# EAGLE design OSO-MISC-20-003 I2C Sensors (EAGLE 9.4.2)
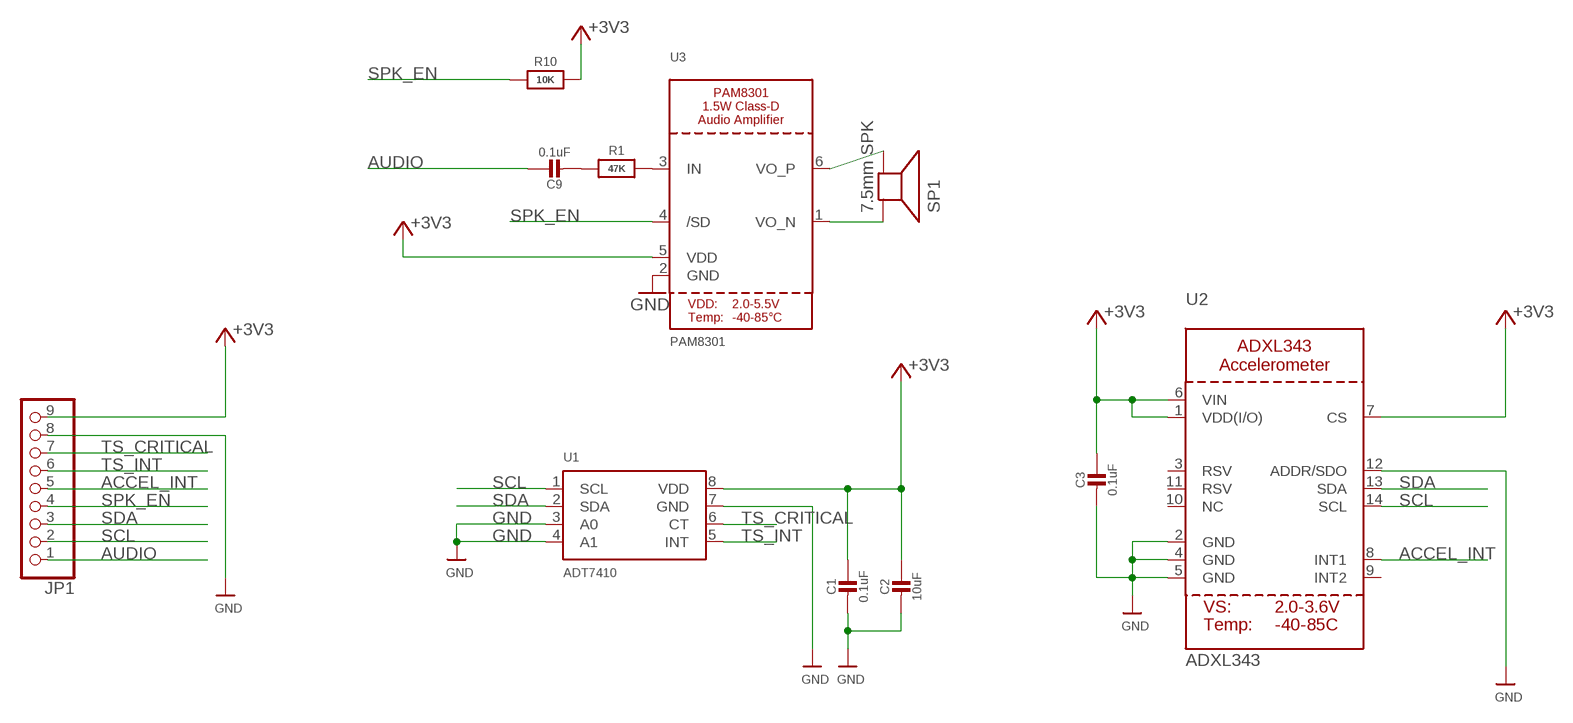
[diagram p0: schematic, sheet 1]

## Parts
C1  0.1uF  CAP_CERAMIC0805-NOOUTLINE  [0805-NO]
C2  10uF  CAP_CERAMIC0805-NOOUTLINE  [0805-NO]
C3  0.1uF  CAP_CERAMIC0805-NOOUTLINE  [0805-NO]
C9  0.1uF  CAP_CERAMIC0805-NOOUTLINE  [0805-NO]
JP1  HEADER-1X9_JSTSH  [JST_SH9]
R1  47K  RESISTOR0805_NOOUTLINE  [0805-NO]
R10  10K  RESISTOR0805_NOOUTLINE  [0805-NO]
SP1  7.5mm SPK  SPEAKER_BUZZER5MM  [BUZZER_SMT_5MM]
U1  ADT7410  TEMP_ADT7410  [SOIC8_150MIL]
U2  ADXL343  ACCEL_ADXL343  [LGA14]
U3  PAM8301  [SOT23-6]

## Nets
+3V3 [gnd]: C1.1 C2.1 C3.1 JP1.9 R10.2 U1.8(VDD) U2.1(VDD(I/O)) U2.6(VIN) U2.7(CS) U3.5(VDD)
ACCEL_INT: JP1.5 U2.8(INT1)
AUDIO: C9.1 JP1.1
GND [gnd]: C1.2 C2.2 C3.2 JP1.8 U1.3(A0) U1.4(A1) U1.7(GND) U2.2(GND) U2.4(GND) U2.5(GND) U2.12(ADDR/SDO) U3.2(GND)
N$6: C9.2 R1.1
N$8: R1.2 U3.3(IN)
SCL: JP1.2 U1.1(SCL) U2.14(SCL)
SDA: JP1.3 U1.2(SDA) U2.13(SDA)
SPK_EN: JP1.4 R10.1 U3.4(/SD)
SPK_N: SP1.+ U3.1(VO_N)
SPK_P: SP1.- U3.6(VO_P)
TS_CRITICAL: JP1.7 U1.6(CT)
TS_INT: JP1.6 U1.5(INT)
Unconnected: U2.3(RSV) U2.9(INT2) U2.10(NC) U2.11(RSV)

## Library data of the parts
C1-C3 C9 = microbuilder:CAP_CERAMIC: Ceramic Capacitors For new designs, use the packages preceded by an '_' character since they are more reliable: The following footprints should be used on most boards: _0402 - Standard footprint for regular board layouts _0603 - Standard footprint for regular board layouts _0805 - Standard footprint for regular board layouts _1206 - Standard footprint for regular board layouts For extremely tight-pitch boards where space is at a premium, the following 'micro-pitch' footprints can be used (smaller pads, no silkscreen outline, etc.): _0402MP - Micro-pitch footprint for very dense/compact boards _0603MP - Micro-pitch footprint for very dense/compact boards _0805MP - Micro-pitch footprint for very dense/compact boards _1206MP - Micro-pitch footprint for very dense/compact boards
JP1 = microbuilder:HEADER-1X9: PIN HEADER
R1 R10 = microbuilder:RESISTOR: Resistors For new designs, use the packages preceded by an '_' character since they are more reliable: The following footprints should be used on most boards: _0402 - Standard footprint for regular board layouts _0603 - Standard footprint for regular board layouts _0805 - Standard footprint for regular board layouts _1206 - Standard footprint for regular board layouts For extremely tight-pitch boards where space is at a premium, the following 'micro-pitch' footprints can be used (smaller pads, no silkscreen outline, etc.): _0402MP - Micro-pitch footprint for very dense/compact boards _0603MP - Micro-pitch footprint for very dense/compact boards _0805MP - Micro-pitch footprint for very dense/compact boards _1206MP - Micro-pitch footprint for very dense/compact boards
SP1 = microbuilder:SPEAKER: SPEAKER Source: Buerklin Added PS12 (for part # PS1240 piezo) http://www.ladyada.net/library/pcb/eaglelibrary.html
U1 = microbuilder:TEMP_ADT7410: ADT7410 - 13-bit 0.5°C I2C Temperature Sensor Operating Voltage: 2.7-5.5V Temperature Range: -55°C-150°C Accuracy: 0.5°C from -40°C-105°C Shutdown Current: 2uA (3.3V) Typical Operating Current (1 Sample/s): 46uA (3.3V) Digikey: ADT7410TRZ-ND
U2 = microbuilder:ACCEL_ADXL343: ADXL343 - Digital Accelerometer 2/4/8/16g
U3 = microbuilder:PAM8301

## Net classes
0 default: width 0.152 mm, drill 0.254 mm
1 power: width 0.305 mm, drill 0.305 mm
2 gnd: width 0.254 mm, drill 0.254 mm

## Board
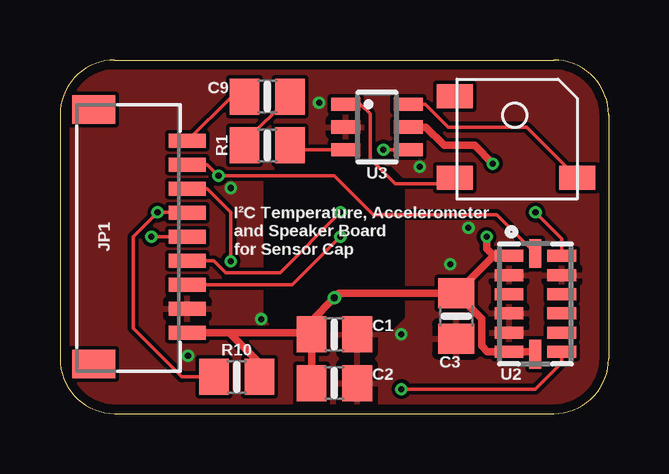
[diagram p1: board, top side]
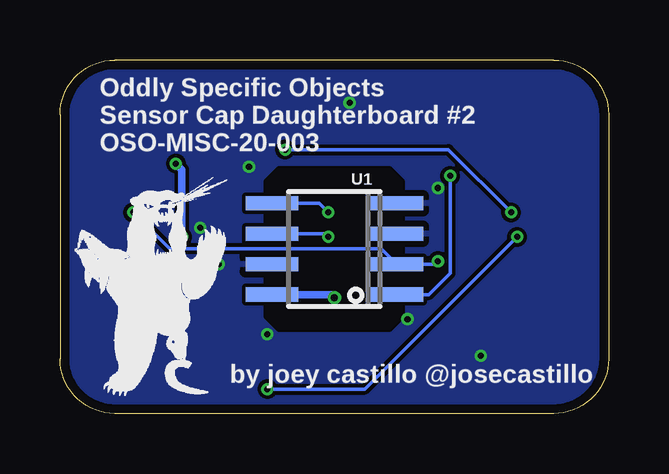
[diagram p2: board, bottom side, seen from below]

Size 22.86 x 14.73 mm. Coordinates in mm from the lower left corner, seen from the top.
Outline: 22.86,12.45 arc90 20.57,14.73 2.29,14.73 arc90 0,12.45 0,2.29 arc90 2.29,0 20.57,0 arc90 22.86,2.29 22.86,12.45
Copper layers (1*16): Top 0.035559375mm / dielectric 1.6mm / Bottom 0.035559375mm
Design rules "oshpark-2layer *": minimum track width 6mil, minimum drill 10mil, track to track 6mil, track to pad 6mil, pad to pad 6mil, via to via 6mil, smd to smd 6mil, copper to edge 15mil, drill to drill 6mil, minimum pad ring 5mil, minimum via ring 5mil, stop-mask expansion 2.5mil, vias tented up to drill 12mil, thermal gap 10mil

### Footprints (pad centres in the part's own frame; a part is rotated, then mirrored left to right if it is on the bottom)
0805-NO = smd 1.24 x 1.5: 1 -0.95,0; 2 0.95,0
JST_SH9 = smd 0.6 x 1.55: 1 -4,2.514; 2 -3,2.514; 3 -2,2.514; 4 -1,2.514; 5 0,2.514; 6 1,2.514; 7 2,2.514; 8 3,2.514; 9 4,2.514 | smd 1.2 x 1.8: MT1 -5.3,-1.386; MT2 5.3,-1.386
BUZZER_SMT_5MM = smd 1.5 x 1: + -2.6,-1.6; - 2.5,-1.6; MT -2.6,1.8
SOIC8_150MIL = smd 0.6 x 2.2: 1 -1.905,-2.6; 2 -0.635,-2.6; 3 0.635,-2.6; 4 1.905,-2.6; 5 1.905,2.6; 6 0.635,2.6; 7 -0.635,2.6; 8 -1.905,2.6
LGA14 = smd 0.5 x 1.2: 1 2,1.1; 2 1.2,1.1; 3 0.4,1.1; 4 -0.4,1.1; 5 -1.2,1.1; 6 -2,1.1; 8 -2,-1.1; 9 -1.2,-1.1; 10 -0.4,-1.1; 11 0.4,-1.1; 12 1.2,-1.1; 13 2,-1.1 | smd 1.2 x 0.5: 7 -2.1,0; 14 2.1,0
SOT23-6 = smd 0.55 x 1.2: 1 -0.95,-1.3; 2 0,-1.3; 3 0.95,-1.3; 4 0.95,1.3; 5 0,1.3; 6 -0.95,1.3

### Placement (x,y rotation side)
C1  11.43,3.3 0 top
C2  11.43,1.27 0 top
C3  16.51,4.06 270 top
C9  8.64,13.21 0 top
JP1  2.79,7.37 270 top
R1  8.64,11.18 0 top
R10  7.37,1.52 0 top
SP1  19.05,11.43 0 top
U1  11.43,6.86 90 bottom
U2  19.81,4.57 90 top
U3  13.21,11.94 270 top
U$3  [OSO_BEAR_250X360MIL_1000DPI]  19.05,5.33 0 bottom

### Tracks (layer width: path | path; a pad name or v marks a point on that pad's centre or on a via)
+3V3  (via drill 0.25, 0.3)
  Top 0.305: JP1.9 7.05,3.37 | R10.2 8.32,2.1 7.05,3.37 | C2.1 C1.1 10.48,3.56 | 10.48,3.56 10.48,3.88 v11.43,4.83 11.62,5.01 C3.1 | U2.7 19.71,2.57 U2.6 17.81,2.57 17.57,2.82 17.57,3.96 C3.1 | U3.5 15.24,11.94 16,11.18 17.27,11.18 v18.03,10.41 | C3.1 18.07,6.57 | 18.07,6.57 U2.1 | v17.78,7.37 17.78,6.86 18.07,6.57 | 7.05,3.37 10.29,3.37 10.48,3.56
  Bottom 0.305: U1.8 11.56,4.95 v11.43,4.83 | v18.03,10.41 17.78,10.16 v17.78,7.37
ACCEL_INT  (via drill 0.25)
  Top 0.152: U2.8 20.91,2.12 19.81,1.02 v14.22,1.02 | v3.81,7.37 JP1.5
  Bottom 0.152: v14.22,1.02 10.16,1.02 v3.81,7.37
AUDIO
  Top 0.152: JP1.1 7.15,13.21 C9.1
GND  (via drill 0.25)
  other vias: 14.22,3.3 10.79,12.95 7.11,9.4 14.99,10.29 17.02,7.75 16.26,6.22 8.38,3.94 5.33,2.41
  pour Bottom: 22.86,14.73 0,14.73 0,0 22.86,0
  pour Top: 22.86,14.73 0,14.73 0,0 22.86,0
  cutout Bottom: 13.72,10.16 9.14,10.16 8.64,9.65 8.64,4.06 9.14,3.56 13.72,3.56 14.22,4.06 14.22,9.65
  cutout Top: 9.14,10.16 13.72,10.16 14.22,9.65 14.22,4.06 13.72,3.56 9.14,3.56 8.64,4.06 8.64,9.65
N$6
  Top 0.152: C9.2 7.69,11.31 R1.1
N$8
  Top 0.152: R1.2 9.77,10.99 U3.3
SCL  (via drill 0.25)
  Top 0.152: JP1.2 6.14,10.37 v6.6,9.91 11.43,9.91 13.05,8.29 18.2,8.29 U2.14
  Bottom 0.152: U1.1 7.49,4.95 6.6,5.84 v6.6,9.91
SDA  (via drill 0.25)
  Top 0.152: JP1.3 6.13,9.37 7.11,8.38 v7.11,6.35 | v19.81,8.38 20.91,7.28 U2.13
  Bottom 0.152: v7.11,6.35 7.24,6.22 U1.2 9.46,6.86 18.29,6.86 v19.81,8.38
SPK_EN  (via drill 0.25)
  Top 0.152: U3.4 13.48,10.99 v13.48,11 | JP1.4 5.29,8.38 v4.06,8.38 3.05,7.37 3.05,3.56 5.08,1.52 R10.1
  Bottom 0.152: v13.48,11 6.68,11 v4.06,8.38
SPK_N
  Top 0.152: SP1.+ 16.2,9.58 13.96,9.58 12.92,10.62 12.92,12.48 12.51,12.89 U3.1
SPK_P
  Top 0.152: SP1.- 19.44,11.94 16.17,11.94 15.22,12.89 U3.6
TS_CRITICAL  (via drill 0.25)
  Top 0.152: v11.68,7.37 9.68,5.37 JP1.7
  Bottom 0.152: U1.6 11.81,7.49 v11.68,7.37
TS_INT  (via drill 0.25)
  Top 0.152: JP1.6 6.41,6.37 6.91,5.87 9.17,5.87 v11.68,8.38
  Bottom 0.152: v11.68,8.38 12.06,8.76 U1.5

### Text on the board
tPlace: I²C Temperature, Accelerometer / and Speaker Board / for Sensor Cap
bPlace: Oddly Specific Objects / Sensor Cap Daughterboard #2 / OSO-MISC-20-003 | by joey castillo @josecastillo